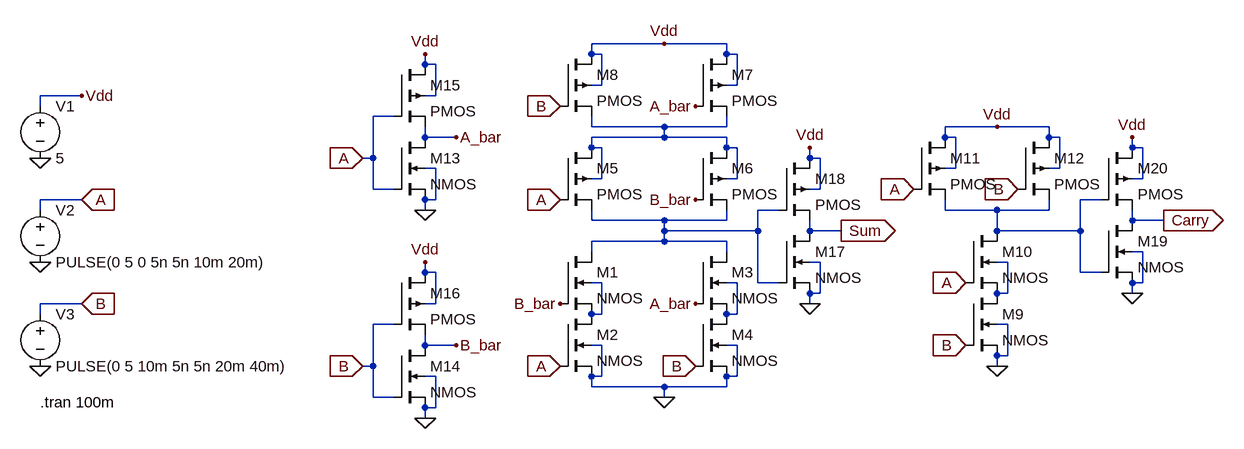
[diagram p0: schematic Half_Adder.asc]
Half_Adder.asc, the LTspice schematic file:
Version 4.1
SHEET 1 1932 680
WIRE 864 -16 752 -16
WIRE 960 -16 864 -16
WIRE 752 0 752 -16
WIRE 768 0 752 0
WIRE 960 0 960 -16
WIRE 976 0 960 0
WIRE 496 16 496 0
WIRE 512 16 496 16
WIRE 768 48 768 0
WIRE 768 48 752 48
WIRE 976 48 976 0
WIRE 976 48 960 48
WIRE -32 64 -96 64
WIRE 512 64 512 16
WIRE 512 64 496 64
WIRE -96 80 -96 64
WIRE 448 96 416 96
WIRE 752 112 752 96
WIRE 864 112 752 112
WIRE 960 112 960 96
WIRE 960 112 864 112
WIRE 1376 112 1296 112
WIRE 1456 112 1376 112
WIRE 496 128 496 112
WIRE 544 128 496 128
WIRE 864 128 864 112
WIRE 864 128 752 128
WIRE 960 128 864 128
WIRE 1296 128 1296 112
WIRE 1312 128 1296 128
WIRE 1456 128 1456 112
WIRE 1472 128 1456 128
WIRE 752 144 752 128
WIRE 768 144 752 144
WIRE 960 144 960 128
WIRE 976 144 960 144
WIRE 1584 144 1584 128
WIRE 1600 144 1584 144
WIRE 416 160 416 96
WIRE 416 160 400 160
WIRE 1088 160 1088 144
WIRE 1104 160 1088 160
WIRE 512 176 496 176
WIRE 1312 176 1312 128
WIRE 1312 176 1296 176
WIRE 1472 176 1472 128
WIRE 1472 176 1456 176
WIRE 768 192 768 144
WIRE 768 192 752 192
WIRE 976 192 976 144
WIRE 976 192 960 192
WIRE 1600 192 1600 144
WIRE 1600 192 1584 192
WIRE 416 208 416 160
WIRE 448 208 416 208
WIRE 1104 208 1104 160
WIRE 1104 208 1088 208
WIRE -32 224 -96 224
WIRE 512 224 512 176
WIRE 512 224 496 224
WIRE 1536 224 1504 224
WIRE -96 240 -96 224
WIRE 496 240 496 224
WIRE 1040 240 1008 240
WIRE 1296 240 1296 224
WIRE 1376 240 1296 240
WIRE 1456 240 1456 224
WIRE 1456 240 1376 240
WIRE 752 256 752 240
WIRE 864 256 752 256
WIRE 960 256 960 240
WIRE 960 256 864 256
WIRE 1584 256 1584 240
WIRE 1632 256 1584 256
WIRE 864 272 864 256
WIRE 1008 272 1008 240
WIRE 1008 272 864 272
WIRE 1088 272 1088 256
WIRE 1136 272 1088 272
WIRE 1376 272 1376 240
WIRE 1504 272 1504 224
WIRE 1504 272 1376 272
WIRE 864 288 864 272
WIRE 864 288 752 288
WIRE 960 288 864 288
WIRE 752 304 752 288
WIRE 960 304 960 288
WIRE 1600 304 1584 304
WIRE 1104 320 1088 320
WIRE 1392 320 1376 320
WIRE 496 336 496 320
WIRE 512 336 496 336
WIRE 1504 336 1504 272
WIRE 1536 336 1504 336
WIRE 768 352 752 352
WIRE 976 352 960 352
WIRE 1008 352 1008 272
WIRE 1040 352 1008 352
WIRE 1600 352 1600 304
WIRE 1600 352 1584 352
WIRE 1104 368 1104 320
WIRE 1104 368 1088 368
WIRE 1392 368 1392 320
WIRE 1392 368 1376 368
WIRE 1584 368 1584 352
WIRE -32 384 -96 384
WIRE 512 384 512 336
WIRE 512 384 496 384
WIRE 1088 384 1088 368
WIRE -96 400 -96 384
WIRE 768 400 768 352
WIRE 768 400 752 400
WIRE 976 400 976 352
WIRE 976 400 960 400
WIRE 448 416 416 416
WIRE 1392 416 1376 416
WIRE 496 448 496 432
WIRE 544 448 496 448
WIRE 768 448 752 448
WIRE 976 448 960 448
WIRE 1392 464 1392 416
WIRE 1392 464 1376 464
WIRE 416 480 416 416
WIRE 416 480 400 480
WIRE 1376 480 1376 464
WIRE 512 496 496 496
WIRE 768 496 768 448
WIRE 768 496 752 496
WIRE 976 496 976 448
WIRE 976 496 960 496
WIRE 752 512 752 496
WIRE 864 512 752 512
WIRE 960 512 960 496
WIRE 960 512 864 512
WIRE 416 528 416 480
WIRE 448 528 416 528
WIRE 864 528 864 512
WIRE 512 544 512 496
WIRE 512 544 496 544
WIRE 496 560 496 544
FLAG -96 160 0
FLAG -96 320 0
FLAG -96 480 0
FLAG -32 64 Vdd
FLAG -32 224 A
IOPIN -32 224 In
FLAG -32 384 B
IOPIN -32 384 In
FLAG 864 528 0
FLAG 864 -16 Vdd
FLAG 1376 480 0
FLAG 1376 112 Vdd
FLAG 1248 208 A
IOPIN 1248 208 In
FLAG 1328 352 A
IOPIN 1328 352 In
FLAG 704 480 A
IOPIN 704 480 In
FLAG 704 224 A
IOPIN 704 224 In
FLAG 1328 448 B
IOPIN 1328 448 In
FLAG 1408 208 B
IOPIN 1408 208 In
FLAG 912 480 B
IOPIN 912 480 In
FLAG 704 80 B
IOPIN 704 80 In
FLAG 704 384 B_bar
FLAG 912 224 B_bar
FLAG 912 384 A_bar
FLAG 912 80 A_bar
FLAG 1136 272 Sum
IOPIN 1136 272 Out
FLAG 1632 256 Carry
IOPIN 1632 256 Out
FLAG 496 560 0
FLAG 496 240 0
FLAG 496 0 Vdd
FLAG 496 320 Vdd
FLAG 400 160 A
IOPIN 400 160 In
FLAG 400 480 B
IOPIN 400 480 In
FLAG 544 128 A_bar
FLAG 544 448 B_bar
FLAG 1088 384 0
FLAG 1088 144 Vdd
FLAG 1584 368 0
FLAG 1584 128 Vdd
SYMBOL voltage -96 64 R0
WINDOW 123 0 0 Left 0
WINDOW 39 0 0 Left 0
SYMATTR InstName V1
SYMATTR Value 5
SYMBOL voltage -96 224 R0
WINDOW 123 0 0 Left 0
WINDOW 39 0 0 Left 0
SYMATTR InstName V2
SYMATTR Value PULSE(0 5 0 5n 5n 10m 20m)
SYMBOL voltage -96 384 R0
WINDOW 123 0 0 Left 0
WINDOW 39 0 0 Left 0
SYMATTR InstName V3
SYMATTR Value PULSE(0 5 10m 5n 5n 20m 40m)
SYMBOL nmos4 704 304 R0
SYMATTR InstName M1
SYMBOL nmos4 704 400 R0
SYMATTR InstName M2
SYMBOL nmos4 912 304 R0
SYMATTR InstName M3
SYMBOL nmos4 912 400 R0
SYMATTR InstName M4
SYMBOL pmos4 704 144 R0
SYMATTR InstName M5
SYMBOL pmos4 912 144 R0
SYMATTR InstName M6
SYMBOL pmos4 912 0 R0
SYMATTR InstName M7
SYMBOL pmos4 704 0 R0
SYMATTR InstName M8
SYMBOL nmos4 1328 368 R0
SYMATTR InstName M9
SYMBOL nmos4 1328 272 R0
SYMATTR InstName M10
SYMBOL pmos4 1248 128 R0
SYMATTR InstName M11
SYMBOL pmos4 1408 128 R0
SYMATTR InstName M12
SYMBOL nmos4 448 128 R0
SYMATTR InstName M13
SYMBOL nmos4 448 448 R0
SYMATTR InstName M14
SYMBOL pmos4 448 16 R0
SYMATTR InstName M15
SYMBOL pmos4 448 336 R0
SYMATTR InstName M16
SYMBOL nmos4 1040 272 R0
SYMATTR InstName M17
SYMBOL pmos4 1040 160 R0
SYMATTR InstName M18
SYMBOL nmos4 1536 256 R0
SYMATTR InstName M19
SYMBOL pmos4 1536 144 R0
SYMATTR InstName M20
TEXT -96 536 Left 2 !.tran 100m

The netlist it stands for:
* Half_Adder.asc
V1 Vdd 0 5
V2 A 0 PULSE(0 5 0 5n 5n 10m 20m)
V3 B 0 PULSE(0 5 10m 5n 5n 20m 40m)
M1 N003 B_bar N005 N005 NMOS
M2 N005 A 0 0 NMOS
M3 N003 A_bar N006 N006 NMOS
M4 N006 B 0 0 NMOS
M5 N001 A N003 N001 PMOS
M6 N001 B_bar N003 N001 PMOS
M7 Vdd A_bar N001 Vdd PMOS
M8 Vdd B N001 Vdd PMOS
M9 N004 B 0 0 NMOS
M10 N002 A N004 N004 NMOS
M11 Vdd A N002 Vdd PMOS
M12 Vdd B N002 Vdd PMOS
M13 A_bar A 0 0 NMOS
M14 B_bar B 0 0 NMOS
M15 Vdd A A_bar Vdd PMOS
M16 Vdd B B_bar Vdd PMOS
M17 Sum N003 0 0 NMOS
M18 Vdd N003 Sum Vdd PMOS
M19 Carry N002 0 0 NMOS
M20 Vdd N002 Carry Vdd PMOS
.model NMOS NMOS
.model PMOS PMOS
.lib standard.mos
.tran 100m
.backanno
.end